# EAGLE design SparkFun-Cherry-MX-Switch-Breakout (EAGLE 7.5.0)
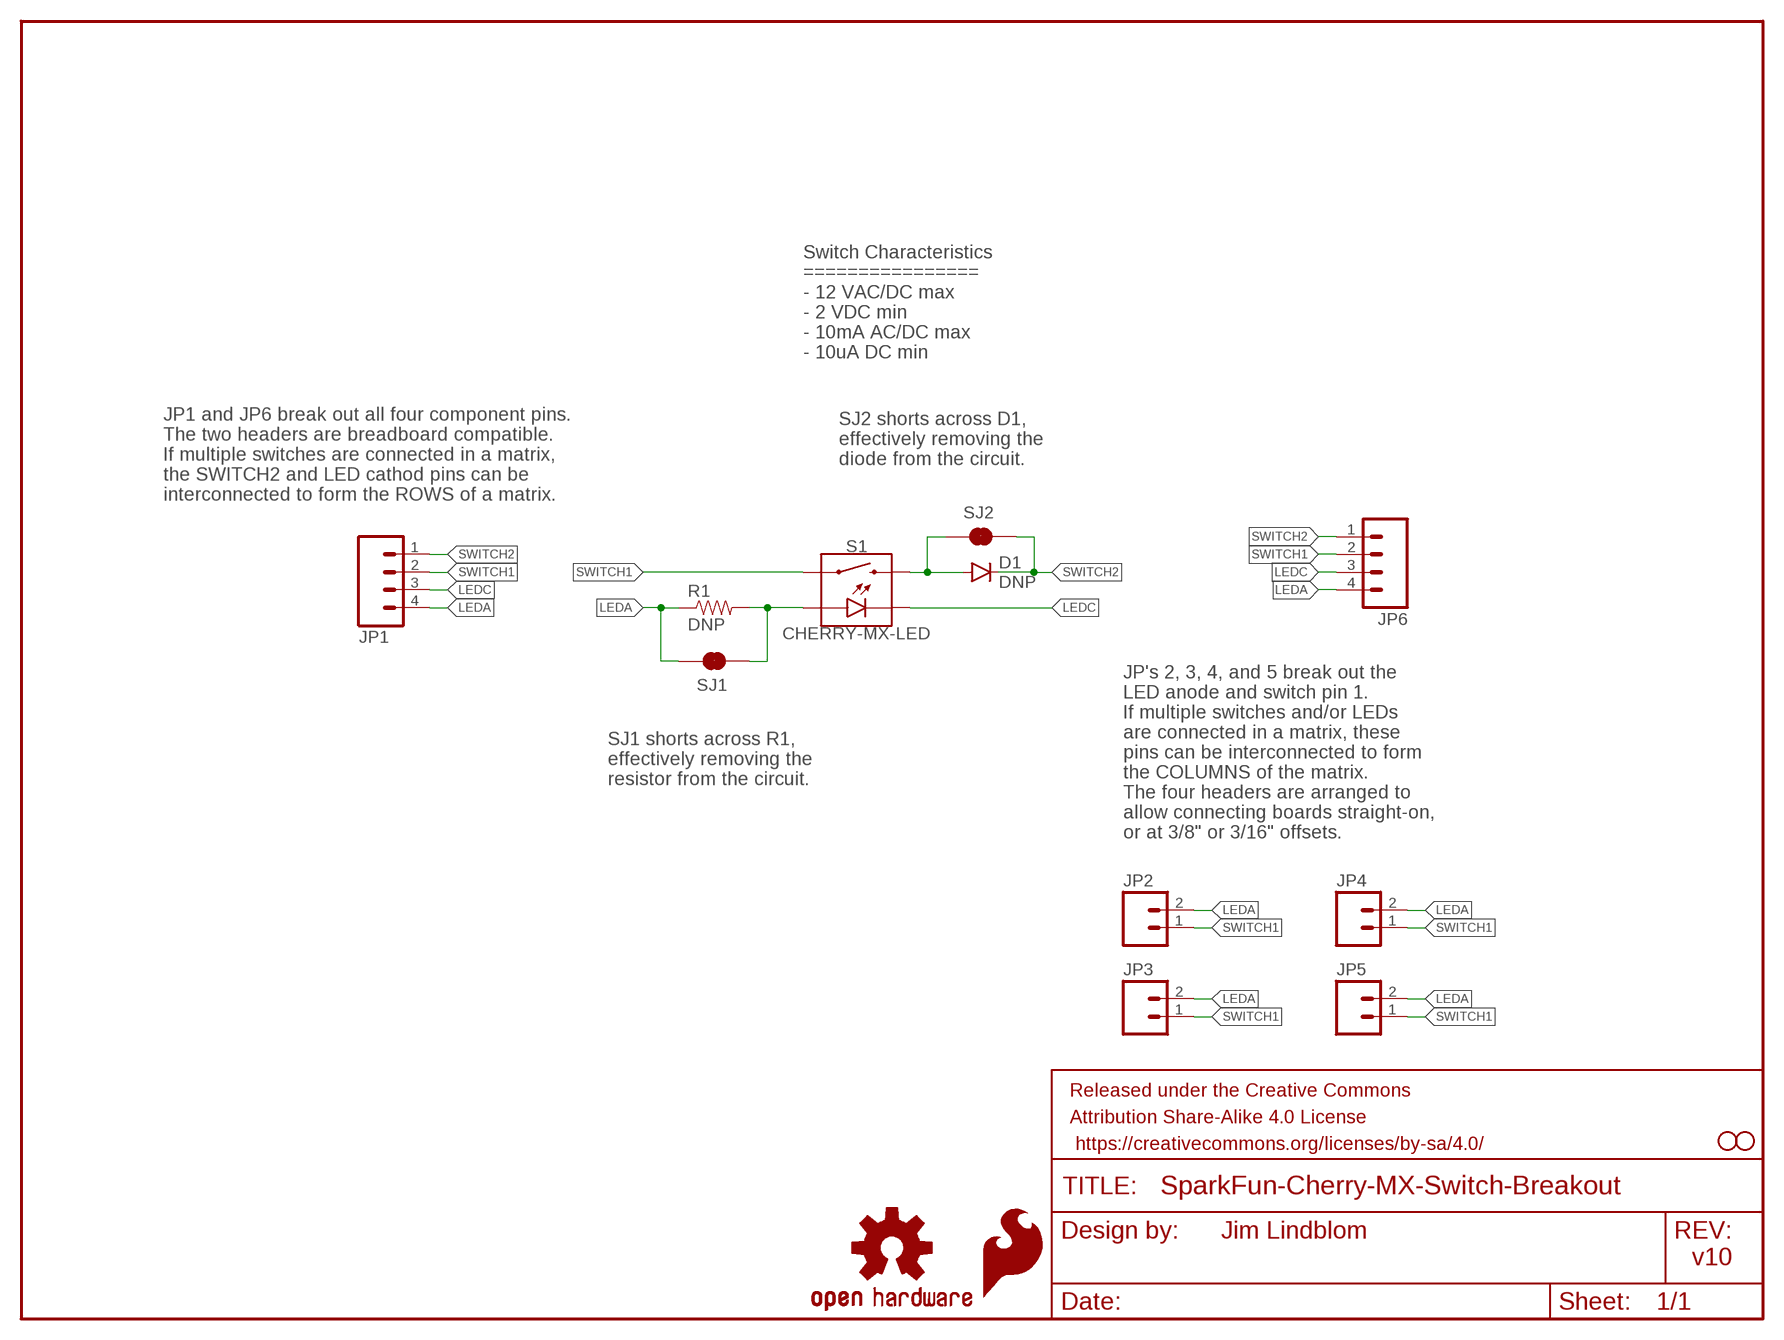
[diagram p0: schematic, sheet 1]

## Parts
D1  DNP  DIODEPTH-VERT-0.1  [DIODE-PTH-0.1]
FRAME1  FRAME-LETTER  [CREATIVE_COMMONS]
JP1  M04NO_SILK_ALL_ROUND  [1X04_NO_SILK_ALL_ROUND]
JP2  M021X02_NO_SILK  [1X02_NO_SILK]
JP3  M021X02_NO_SILK  [1X02_NO_SILK]
JP4  M021X02_NO_SILK  [1X02_NO_SILK]
JP5  M021X02_NO_SILK  [1X02_NO_SILK]
JP6  M04NO_SILK_ALL_ROUND  [1X04_NO_SILK_ALL_ROUND]
LOGO1  OSHW-LOGOS  [OSHW-LOGO-S]
LOGO2  SFE_LOGO_FLAME.1_INCH  [SFE_LOGO_FLAME_.1]
R1  DNP  RESISTORPTH-1/4W-VERT  [AXIAL-0.1]
S1  CHERRY-MX-LED  [CHERRY-MX-LED]
SJ1  JUMPER-PAD-2-NC_BY_TRACENO_SILK  [PAD-JUMPER-2-NC_BY_TRACE_NO_SILK]
SJ2  JUMPER-PAD-2-NC_BY_TRACENO_SILK  [PAD-JUMPER-2-NC_BY_TRACE_NO_SILK]
STANDOFF1  STAND-OFF2-56  [STAND-OFF-2-56]
STANDOFF2  STAND-OFF2-56  [STAND-OFF-2-56]

## Nets
LEDA: JP1.4 JP2.2 JP3.2 JP4.2 JP5.2 JP6.4 R1.P$1 SJ1.1
LEDC: JP1.3 JP6.3 S1.K(C)
N$1: R1.P$2 S1.A SJ1.2
N$3: D1.A S1.S2 SJ2.1
SWITCH1: JP1.2 JP2.1 JP3.1 JP4.1 JP5.1 JP6.2 S1.S1
SWITCH2: D1.C JP1.1 JP6.1 SJ2.2

## Notes on the sheet
- Switch Characteristics
  ================
  - 12 VAC/DC max
  - 2 VDC min
  - 10mA AC/DC max
  - 10uA DC min
- SJ2 shorts across D1, 
  effectively removing the 
  diode from the circuit.
- JP1 and JP6 break out all four component pins.
  The two headers are breadboard compatible.
  If multiple switches are connected in a matrix, 
  the SWITCH2 and LED cathod pins can be
  interconnected to form the ROWS of a matrix.
- SJ1 shorts across R1, 
  effectively removing the 
  resistor from the circuit.
- JP's 2, 3, 4, and 5 break out the 
  LED anode and switch pin 1.
  If multiple switches and/or LEDs 
  are connected in a matrix, these 
  pins can be interconnected to form 
  the COLUMNS of the matrix.
  The four headers are arranged to 
  allow connecting boards straight-on,
  or at 3/8" or 3/16" offsets.
- Jim Lindblom
- v10

## Library data of the parts
D1 = cherry-temp:DIODE: Diode These are standard reverse protection diodes and small signal diodes. SMA package can handle up to about 1A. SOD-323 can handle about 200mA. What the SOD-323 package when ordering, there are some mfgs out there that are 5-pin packages.
FRAME1 = SparkFun-Aesthetics:FRAME-LETTER: Schematic Frame Standard 8.5x11 US Letter frame
JP1 JP6 = SparkFun-Connectors:M04: Header 4 Standard 4-pin 0.1" header. Use with straight break away headers (SKU : PRT-00116), right angle break away headers (PRT-00553), swiss pins (PRT-00743), machine pins (PRT-00117), and female headers (PRT-00115). Molex polarized connector foot print use with SKU : PRT-08231 with associated crimp pins and housings. 1MM SMD Version SKU: PRT-10208
JP2-JP5 = SparkFun-Connectors:M02: Standard 2-pin 0.1" header. Use with - straight break away headers ( PRT-00116) - right angle break away headers (PRT-00553) - swiss pins (PRT-00743) - machine pins (PRT-00117) - female headers (PRT-00115) Molex polarized connector foot print use with: PRT-08233 with associated crimp pins and housings. 2.54_SCREWTERM for use with PRT-10571. 3.5mm Screw Terminal footprints for PRT-08084 5mm Screw Terminal footprints for use with PRT-08432
LOGO1 = SparkFun-Aesthetics:OSHW-LOGO: Open Source Hardware Logo This logo indicates the piece of hardware it is found on incorporates a OSHW license and/or adheres to the definition of open source hardware found here: http://freedomdefined.org/OSHW
LOGO2 = SparkFun-Aesthetics:SFE_LOGO_FLAME: SFE Logo, flame only This is the SparkFun flame logo. The logo on the schematic will always be the same size; the package variant is the height of the flame. Default layer for the logo on the board is tSilk.
R1 = SparkFun-Resistors:RESISTOR: Resistor Basic schematic elements and footprints for 0603, 1206, and PTH resistors.
S1 = cherry-temp:CHERRY-MX-LED
SJ1 SJ2 = SparkFun-Passives:JUMPER-PAD-2-NC_BY_TRACE
STANDOFF1 STANDOFF2 = cherry-temp:STAND-OFF: #4 Stand Off This is the mechanical footprint for a #4 phillips button head screw. Use the keepout ring to avoid running the screw head into surrounding components. SKU : PRT-00447

## Board
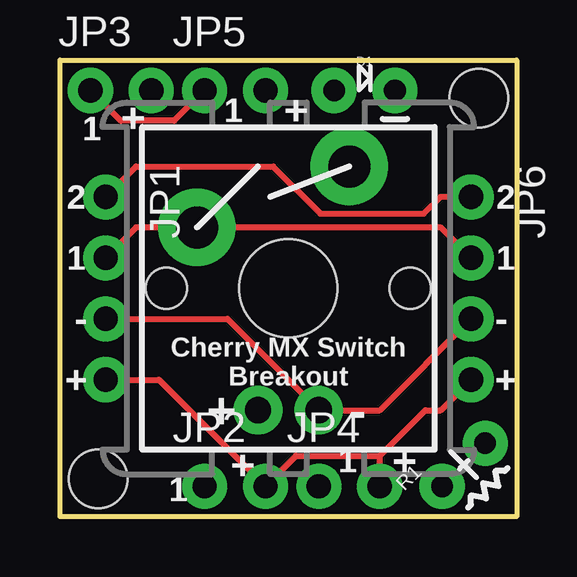
[diagram p1: board, top side]
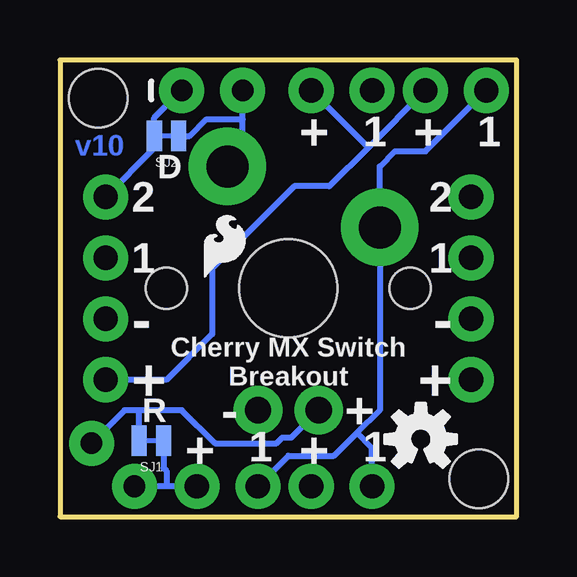
[diagram p2: board, bottom side, seen from below]

Size 19.05 x 19.05 mm. Coordinates in mm from the lower left corner, seen from the top.
Outline: 0,0 0,19.05 19.05,19.05 19.05,0 0,0
Copper layers (1*16): Top 0.035mm / dielectric 1.5mm / Bottom 0.035mm
Design rules "SparkFun-2-layer-STANDARD": minimum track width 10mil, minimum drill 20mil, track to track 10mil, track to pad 8mil, pad to pad 8mil, via to via 10mil, smd to smd 8mil, copper to edge 8mil, drill to drill 8mil, minimum pad ring 10mil, minimum via ring 10mil, stop-mask expansion 4mil, vias tented up to drill 20mil, thermal gap 10mil

### Footprints (pad centres in the part's own frame; a part is rotated, then mirrored left to right if it is on the bottom)
DIODE-PTH-0.1 = drill 0.9 pad 1.88: A -1.27,0; C 1.27,0
1X04_NO_SILK_ALL_ROUND = drill 1.016 pad 1.88: 1 0,0; 2 2.54,0; 3 5.08,0; 4 7.62,0
1X02_NO_SILK = drill 1.016 pad 1.88: 1 0,0; 2 2.54,0
AXIAL-0.1 = drill 0.9 pad 1.88: P$1 0,0; P$2 2.54,0
CHERRY-MX-LED = drill 1.092 pad 2.032: A -1.27,-5.08; K 1.27,-5.08 | drill 1.753 pad 3.226: S1 -3.81,2.54; S2 2.54,5.08 | hole 4.089: 0,0 | hole 1.707: -5.08,0; 5.08,0
PAD-JUMPER-2-NC_BY_TRACE_NO_SILK = smd 0.635 x 1.27: 1 -0.508,0; 2 0.508,0
STAND-OFF-2-56 = hole 2.438: 0,0

### Placement (x,y rotation side)
D1  12.7,17.78 0 top
FRAME1  -6.35,-21.59 0 top  (outside the outline)
JP1  1.91,13.34 270 top
JP2  6.03,1.27 0 top
JP3  1.27,17.78 0 top
JP4  10.79,1.27 0 top
JP5  6.03,17.78 0 top
JP6  17.14,13.34 270 top
LOGO1  4,3.24 0 bottom
LOGO2  13.34,9.65 0 bottom
R1  15.94,1.27 45 top
S1  9.53,9.53 0 top
SJ1  15.24,3.17 180 bottom
SJ2  14.61,15.88 180 bottom
STANDOFF1  17.46,17.46 0 top
STANDOFF2  1.59,1.59 0 top

### Tracks (layer width: path | path; a pad name or v marks a point on that pad's centre or on a via)
LEDA
  Top 0.254: JP1.4 4.13,5.71 JP2.2 9.84,2.54 13.34,2.54 | JP4.2 13.34,2.54 | 13.34,2.54 15.24,4.45 15.88,4.45 JP6.4
  Bottom 0.254: JP5.2 6.19,15.4 | JP3.2 6.19,15.4 | 6.19,15.4 7.81,13.78 9.27,13.78 12.7,10.35 12.7,7.62 14.61,5.71 JP6.4 | JP4.2 14.61,1.27 | 14.61,1.27 R1.P$1 | SJ1.1 14.73,2.03 14.61,1.91 14.61,1.27
LEDC
  Top 0.254: JP1.3 6.99,8.26 S1.K 13.34,4.45 JP6.3
N$1
  Bottom 0.254: S1.A 9.4,3.3 9.78,3.3 10.02,3.07 12.59,3.07 13.97,4.45 15.75,4.45 | 15.75,4.45 16.36,4.45 R1.P$2 | SJ1.2 15.75,4.45
N$3
  Bottom 0.254: S1.S2 11.43,15.24 11.43,16.57 | 11.43,16.57 D1.A | SJ2.1 13.65,15.88 12.95,16.57 11.43,16.57
SWITCH1
  Top 0.254: JP3.1 2.54,16.51 4.76,16.51 JP5.1 | JP6.2 15.88,12.06 S1.S1 3.17,12.06 JP1.2
  Bottom 0.254: JP4.1 9.53,2.54 7.62,2.54 6.67,3.49 | 6.67,3.49 5.71,4.45 S1.S1 5.71,14.61 5.08,15.24 3.81,15.24 JP3.1 | JP2.1 6.03,2.86 6.67,3.49
SWITCH2
  Top 0.254: JP1.1 3.17,14.61 8.89,14.61 10.86,12.64 15.18,12.64 15.88,13.34 JP6.1
  Bottom 0.254: D1.C 15.11,16.64 SJ2.2 15.11,15.37 JP6.1

### Text on the board
Bottom: v10
tPlace: + | 1 | + | 1 | 2 | 2 | 1 | 1 | - | - | + | Cherry MX Switch / Breakout | + | + | 1 | + | 1
bPlace: 1 | + | 1 | + | D | 2 | 2 | 1 | 1 | - | - | + | Cherry MX Switch / Breakout | + | + | - | R | 1 | + | 1 | +
Measures: Units in inches
tDocu: Jim Lindblom